# Altium schematic sheet USBDAC_pcm2706_pcm5102a.SchDoc
size A4
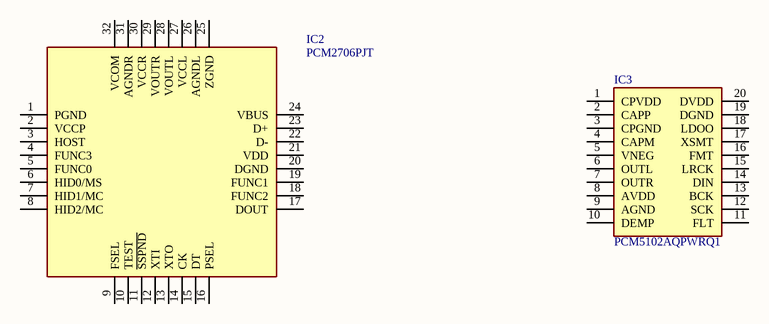
[diagram p0: USBDAC_pcm2706_pcm5102a.SchDoc]

## Parts
IC2  PCM2706PJT  [QFP80P900X900X120-32N]
IC3  PCM5102AQPWRQ1  [SOP65P640X120-20N]

## Nets

Not connected (* = marked no-connect by the designer): IC2 1(PGND) 2(VCCP) 3(HOST) 4(FUNC3) 5(FUNC0) 6(HID0/MS) 7(HID1/MC) 8(HID2/MC) 9(FSEL) 10(TEST) 11(~{SSPND}) 12(XTI) 13(XTO) 14(CK) 15(DT) 16(PSEL) 17(DOUT) 18(FUNC2) 19(FUNC1) 20(DGND) 21(VDD) 22(D-) 23(D+) 24(VBUS) 25(ZGND) 26(AGNDL) 27(VCCL) 28(VOUTL) 29(VOUTR) 30(VCCR) 31(AGNDR) 32(VCOM); IC3 1(CPVDD) 2(CAPP) 3(CPGND) 4(CAPM) 5(VNEG) 6(OUTL) 7(OUTR) 8(AVDD) 9(AGND) 10(DEMP) 11(FLT) 12(SCK) 13(BCK) 14(DIN) 15(LRCK) 16(FMT) 17(XSMT) 18(LDOO) 19(DGND) 20(DVDD)

## Library data of the parts
IC2 = PCM2706PJT: Integrated Circuit; Manufacturer_Name: Texas Instruments; Datasheet Link: http://www.ti.com/lit/gpn/pcm2706; Height: 1.2mm; Manufacturer_Part_Number: PCM2706PJT
IC3 = PCM5102AQPWRQ1: Integrated Circuit; Manufacturer_Name: Texas Instruments; Datasheet Link: http://www.ti.com/lit/gpn/pcm5102a-q1; Height: 1.2mm; Mouser2 Part Number: 595-PCM5102AQPWRQ1; Mouser2 Price/Stock: https://www.mouser.com/Search/Refine.aspx?Keyword=595-PCM5102AQPWRQ1; Manufacturer_Part_Number: PCM5102AQPWRQ1